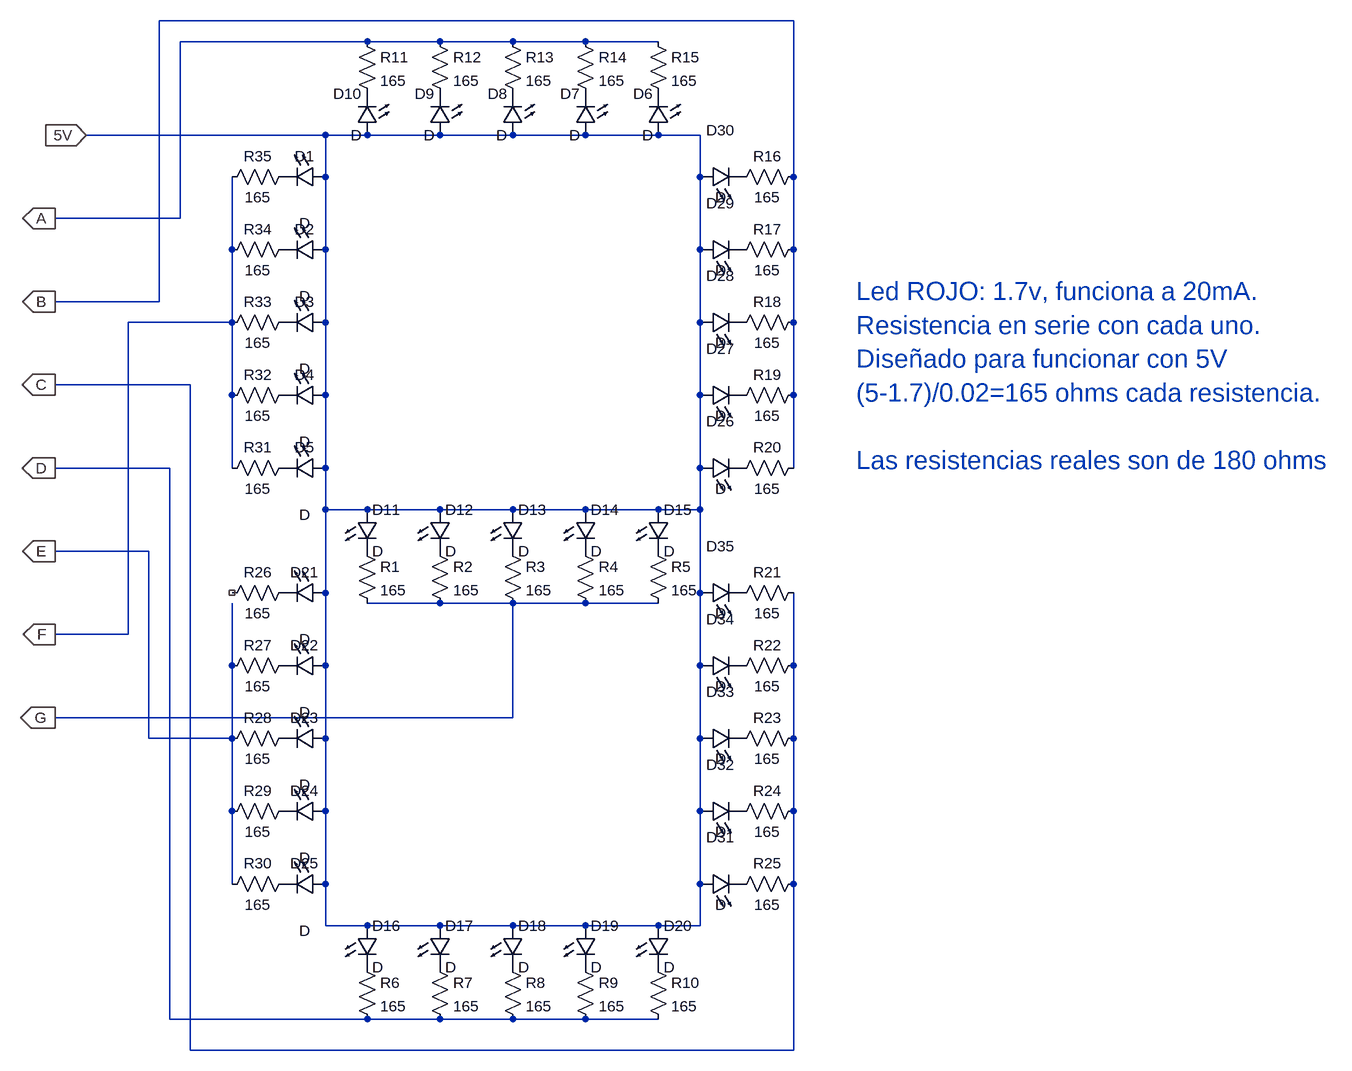
[diagram p0: schematic Display 7 segmentos.asc]
Display 7 segmentos.asc, the LTspice schematic file:
Version 4
SHEET 1 1560 1508
WIRE 592 -80 -384 -80
WIRE -64 -48 -352 -48
WIRE 48 -48 -64 -48
WIRE 160 -48 48 -48
WIRE 272 -48 160 -48
WIRE 384 -48 272 -48
WIRE -128 96 -496 96
WIRE -64 96 -128 96
WIRE 48 96 -64 96
WIRE 160 96 48 96
WIRE 272 96 160 96
WIRE 384 96 272 96
WIRE 448 96 384 96
WIRE -128 160 -128 96
WIRE 448 160 448 96
WIRE 592 160 592 -80
WIRE -352 224 -352 -48
WIRE -352 224 -544 224
WIRE -272 272 -272 160
WIRE -128 272 -128 160
WIRE 448 272 448 160
WIRE 592 272 592 160
WIRE -384 352 -384 -80
WIRE -384 352 -544 352
WIRE -272 384 -272 272
WIRE -272 384 -432 384
WIRE -128 384 -128 272
WIRE 448 384 448 272
WIRE 592 384 592 272
WIRE -336 480 -544 480
WIRE -272 496 -272 384
WIRE -128 496 -128 384
WIRE 448 496 448 384
WIRE 592 496 592 384
WIRE -368 608 -544 608
WIRE -272 608 -272 496
WIRE -128 608 -128 496
WIRE 448 608 448 496
WIRE 592 608 592 496
WIRE -128 672 -128 608
WIRE -64 672 -128 672
WIRE 48 672 -64 672
WIRE 160 672 48 672
WIRE 272 672 160 672
WIRE 384 672 272 672
WIRE 448 672 448 608
WIRE 448 672 384 672
WIRE -400 736 -544 736
WIRE -128 800 -128 672
WIRE 448 800 448 672
WIRE 48 816 -64 816
WIRE 160 816 48 816
WIRE 272 816 160 816
WIRE 384 816 272 816
WIRE -432 864 -432 384
WIRE -432 864 -544 864
WIRE -272 912 -272 816
WIRE -128 912 -128 800
WIRE 448 912 448 800
WIRE 592 912 592 800
WIRE 160 992 160 816
WIRE 160 992 -544 992
WIRE -400 1024 -400 736
WIRE -272 1024 -272 912
WIRE -272 1024 -400 1024
WIRE -128 1024 -128 912
WIRE 448 1024 448 912
WIRE 592 1024 592 912
WIRE -272 1136 -272 1024
WIRE -128 1136 -128 1024
WIRE 448 1136 448 1024
WIRE 592 1136 592 1024
WIRE -272 1248 -272 1136
WIRE -128 1248 -128 1136
WIRE 448 1248 448 1136
WIRE 592 1248 592 1136
WIRE -128 1312 -128 1248
WIRE -64 1312 -128 1312
WIRE 48 1312 -64 1312
WIRE 160 1312 48 1312
WIRE 272 1312 160 1312
WIRE 384 1312 272 1312
WIRE 448 1312 448 1248
WIRE 448 1312 384 1312
WIRE -368 1456 -368 608
WIRE -64 1456 -368 1456
WIRE 48 1456 -64 1456
WIRE 160 1456 48 1456
WIRE 272 1456 160 1456
WIRE 384 1456 272 1456
WIRE -336 1504 -336 480
WIRE 592 1504 592 1248
WIRE 592 1504 -336 1504
FLAG -496 96 5V
IOPIN -496 96 In
FLAG -544 224 A
IOPIN -544 224 Out
FLAG -544 352 B
IOPIN -544 352 Out
FLAG -544 480 C
IOPIN -544 480 Out
FLAG -544 608 D
IOPIN -544 608 Out
FLAG -544 736 E
IOPIN -544 736 Out
FLAG -544 864 F
IOPIN -544 864 Out
FLAG -544 992 G
IOPIN -544 992 Out
SYMBOL LED -128 144 R90
WINDOW 0 0 32 VBottom 2
WINDOW 3 72 32 VTop 2
SYMATTR InstName D1
SYMBOL LED -128 256 R90
WINDOW 0 0 32 VBottom 2
WINDOW 3 72 32 VTop 2
SYMATTR InstName D2
SYMBOL LED -128 368 R90
WINDOW 0 0 32 VBottom 2
WINDOW 3 72 32 VTop 2
SYMATTR InstName D3
SYMBOL LED -128 480 R90
WINDOW 0 0 32 VBottom 2
WINDOW 3 72 32 VTop 2
SYMATTR InstName D4
SYMBOL LED -128 592 R90
WINDOW 0 0 32 VBottom 2
WINDOW 3 72 32 VTop 2
SYMATTR InstName D5
SYMBOL LED 400 96 R180
WINDOW 0 24 64 Left 2
WINDOW 3 24 0 Left 2
SYMATTR InstName D6
SYMBOL LED 288 96 R180
WINDOW 0 24 64 Left 2
WINDOW 3 24 0 Left 2
SYMATTR InstName D7
SYMBOL LED 176 96 R180
WINDOW 0 24 64 Left 2
WINDOW 3 24 0 Left 2
SYMATTR InstName D8
SYMBOL LED 64 96 R180
WINDOW 0 24 64 Left 2
WINDOW 3 24 0 Left 2
SYMATTR InstName D9
SYMBOL LED -48 96 R180
WINDOW 0 24 64 Left 2
WINDOW 3 24 0 Left 2
SYMATTR InstName D10
SYMBOL LED -80 672 R0
SYMATTR InstName D11
SYMBOL LED 32 672 R0
SYMATTR InstName D12
SYMBOL LED 144 672 R0
SYMATTR InstName D13
SYMBOL LED 256 672 R0
SYMATTR InstName D14
SYMBOL LED 368 672 R0
SYMATTR InstName D15
SYMBOL LED -80 1312 R0
SYMATTR InstName D16
SYMBOL LED 32 1312 R0
SYMATTR InstName D17
SYMBOL LED 144 1312 R0
SYMATTR InstName D18
SYMBOL LED 256 1312 R0
SYMATTR InstName D19
SYMBOL LED 368 1312 R0
SYMATTR InstName D20
SYMBOL LED -128 784 R90
WINDOW 0 0 32 VBottom 2
WINDOW 3 72 32 VTop 2
SYMATTR InstName D21
SYMBOL LED -128 896 R90
WINDOW 0 0 32 VBottom 2
WINDOW 3 72 32 VTop 2
SYMATTR InstName D22
SYMBOL LED -128 1008 R90
WINDOW 0 0 32 VBottom 2
WINDOW 3 72 32 VTop 2
SYMATTR InstName D23
SYMBOL LED -128 1120 R90
WINDOW 0 0 32 VBottom 2
WINDOW 3 72 32 VTop 2
SYMATTR InstName D24
SYMBOL LED -128 1232 R90
WINDOW 0 0 32 VBottom 2
WINDOW 3 72 32 VTop 2
SYMATTR InstName D25
SYMBOL LED 448 624 R270
WINDOW 0 72 32 VTop 2
WINDOW 3 0 32 VBottom 2
SYMATTR InstName D26
SYMBOL LED 448 512 R270
WINDOW 0 72 32 VTop 2
WINDOW 3 0 32 VBottom 2
SYMATTR InstName D27
SYMBOL LED 448 400 R270
WINDOW 0 72 32 VTop 2
WINDOW 3 0 32 VBottom 2
SYMATTR InstName D28
SYMBOL LED 448 288 R270
WINDOW 0 72 32 VTop 2
WINDOW 3 0 32 VBottom 2
SYMATTR InstName D29
SYMBOL LED 448 176 R270
WINDOW 0 72 32 VTop 2
WINDOW 3 0 32 VBottom 2
SYMATTR InstName D30
SYMBOL LED 448 1264 R270
WINDOW 0 72 32 VTop 2
WINDOW 3 0 32 VBottom 2
SYMATTR InstName D31
SYMBOL LED 448 1152 R270
WINDOW 0 72 32 VTop 2
WINDOW 3 0 32 VBottom 2
SYMATTR InstName D32
SYMBOL LED 448 1040 R270
WINDOW 0 72 32 VTop 2
WINDOW 3 0 32 VBottom 2
SYMATTR InstName D33
SYMBOL LED 448 928 R270
WINDOW 0 72 32 VTop 2
WINDOW 3 0 32 VBottom 2
SYMATTR InstName D34
SYMBOL LED 448 816 R270
WINDOW 0 72 32 VTop 2
WINDOW 3 0 32 VBottom 2
SYMATTR InstName D35
SYMBOL res -80 720 R0
SYMATTR InstName R1
SYMATTR Value 165
SYMATTR SpiceLine tol=5 pwr=1/4
SYMBOL res 32 720 R0
SYMATTR InstName R2
SYMATTR Value 165
SYMATTR SpiceLine tol=5 pwr=1/4
SYMBOL res 144 720 R0
SYMATTR InstName R3
SYMATTR Value 165
SYMATTR SpiceLine tol=5 pwr=1/4
SYMBOL res 256 720 R0
SYMATTR InstName R4
SYMATTR Value 165
SYMATTR SpiceLine tol=5 pwr=1/4
SYMBOL res 368 720 R0
SYMATTR InstName R5
SYMATTR Value 165
SYMATTR SpiceLine tol=5 pwr=1/4
SYMBOL res -80 1360 R0
SYMATTR InstName R6
SYMATTR Value 165
SYMATTR SpiceLine tol=5 pwr=1/4
SYMBOL res 32 1360 R0
SYMATTR InstName R7
SYMATTR Value 165
SYMATTR SpiceLine tol=5 pwr=1/4
SYMBOL res 144 1360 R0
SYMATTR InstName R8
SYMATTR Value 165
SYMATTR SpiceLine tol=5 pwr=1/4
SYMBOL res 256 1360 R0
SYMATTR InstName R9
SYMATTR Value 165
SYMATTR SpiceLine tol=5 pwr=1/4
SYMBOL res 368 1360 R0
SYMATTR InstName R10
SYMATTR Value 165
SYMATTR SpiceLine tol=5 pwr=1/4
SYMBOL res -80 -64 R0
SYMATTR InstName R11
SYMATTR Value 165
SYMATTR SpiceLine tol=5 pwr=1/4
SYMBOL res 32 -64 R0
SYMATTR InstName R12
SYMATTR Value 165
SYMATTR SpiceLine tol=5 pwr=1/4
SYMBOL res 144 -64 R0
SYMATTR InstName R13
SYMATTR Value 165
SYMATTR SpiceLine tol=5 pwr=1/4
SYMBOL res 256 -64 R0
SYMATTR InstName R14
SYMATTR Value 165
SYMATTR SpiceLine tol=5 pwr=1/4
SYMBOL res 368 -64 R0
SYMATTR InstName R15
SYMATTR Value 165
SYMATTR SpiceLine tol=5 pwr=1/4
SYMBOL res 608 144 R90
WINDOW 0 0 56 VBottom 2
WINDOW 3 32 56 VTop 2
SYMATTR InstName R16
SYMATTR Value 165
SYMATTR SpiceLine tol=5 pwr=1/4
SYMBOL res 608 256 R90
WINDOW 0 0 56 VBottom 2
WINDOW 3 32 56 VTop 2
SYMATTR InstName R17
SYMATTR Value 165
SYMATTR SpiceLine tol=5 pwr=1/4
SYMBOL res 608 368 R90
WINDOW 0 0 56 VBottom 2
WINDOW 3 32 56 VTop 2
SYMATTR InstName R18
SYMATTR Value 165
SYMATTR SpiceLine tol=5 pwr=1/4
SYMBOL res 608 480 R90
WINDOW 0 0 56 VBottom 2
WINDOW 3 32 56 VTop 2
SYMATTR InstName R19
SYMATTR Value 165
SYMATTR SpiceLine tol=5 pwr=1/4
SYMBOL res 608 592 R90
WINDOW 0 0 56 VBottom 2
WINDOW 3 32 56 VTop 2
SYMATTR InstName R20
SYMATTR Value 165
SYMATTR SpiceLine tol=5 pwr=1/4
SYMBOL res 608 784 R90
WINDOW 0 0 56 VBottom 2
WINDOW 3 32 56 VTop 2
SYMATTR InstName R21
SYMATTR Value 165
SYMATTR SpiceLine tol=5 pwr=1/4
SYMBOL res 608 896 R90
WINDOW 0 0 56 VBottom 2
WINDOW 3 32 56 VTop 2
SYMATTR InstName R22
SYMATTR Value 165
SYMATTR SpiceLine tol=5 pwr=1/4
SYMBOL res 608 1008 R90
WINDOW 0 0 56 VBottom 2
WINDOW 3 32 56 VTop 2
SYMATTR InstName R23
SYMATTR Value 165
SYMATTR SpiceLine tol=5 pwr=1/4
SYMBOL res 608 1120 R90
WINDOW 0 0 56 VBottom 2
WINDOW 3 32 56 VTop 2
SYMATTR InstName R24
SYMATTR Value 165
SYMATTR SpiceLine tol=5 pwr=1/4
SYMBOL res 608 1232 R90
WINDOW 0 0 56 VBottom 2
WINDOW 3 32 56 VTop 2
SYMATTR InstName R25
SYMATTR Value 165
SYMATTR SpiceLine tol=5 pwr=1/4
SYMBOL res -176 784 R90
WINDOW 0 0 56 VBottom 2
WINDOW 3 32 56 VTop 2
SYMATTR InstName R26
SYMATTR Value 165
SYMATTR SpiceLine tol=5 pwr=1/4
SYMBOL res -176 896 R90
WINDOW 0 0 56 VBottom 2
WINDOW 3 32 56 VTop 2
SYMATTR InstName R27
SYMATTR Value 165
SYMATTR SpiceLine tol=5 pwr=1/4
SYMBOL res -176 1008 R90
WINDOW 0 0 56 VBottom 2
WINDOW 3 32 56 VTop 2
SYMATTR InstName R28
SYMATTR Value 165
SYMATTR SpiceLine tol=5 pwr=1/4
SYMBOL res -176 1120 R90
WINDOW 0 0 56 VBottom 2
WINDOW 3 32 56 VTop 2
SYMATTR InstName R29
SYMATTR Value 165
SYMATTR SpiceLine tol=5 pwr=1/4
SYMBOL res -176 1232 R90
WINDOW 0 0 56 VBottom 2
WINDOW 3 32 56 VTop 2
SYMATTR InstName R30
SYMATTR Value 165
SYMATTR SpiceLine tol=5 pwr=1/4
SYMBOL res -176 592 R90
WINDOW 0 0 56 VBottom 2
WINDOW 3 32 56 VTop 2
SYMATTR InstName R31
SYMATTR Value 165
SYMATTR SpiceLine tol=5 pwr=1/4
SYMBOL res -176 480 R90
WINDOW 0 0 56 VBottom 2
WINDOW 3 32 56 VTop 2
SYMATTR InstName R32
SYMATTR Value 165
SYMATTR SpiceLine tol=5 pwr=1/4
SYMBOL res -176 368 R90
WINDOW 0 0 56 VBottom 2
WINDOW 3 32 56 VTop 2
SYMATTR InstName R33
SYMATTR Value 165
SYMATTR SpiceLine tol=5 pwr=1/4
SYMBOL res -176 256 R90
WINDOW 0 0 56 VBottom 2
WINDOW 3 32 56 VTop 2
SYMATTR InstName R34
SYMATTR Value 165
SYMATTR SpiceLine tol=5 pwr=1/4
SYMBOL res -176 144 R90
WINDOW 0 0 56 VBottom 2
WINDOW 3 32 56 VTop 2
SYMATTR InstName R35
SYMATTR Value 165
SYMATTR SpiceLine tol=5 pwr=1/4
TEXT 688 336 Left 4 ;Led ROJO: 1.7v, funciona a 20mA.\nResistencia en serie con cada uno.\nDiseñado para funcionar con 5V\n(5-1.7)/0.02=165 ohms cada resistencia.\n \nLas resistencias reales son de 180 ohms

The netlist it stands for:
* Display 7 segmentos.asc
D1 5V P001 D
D2 5V P002 D
D3 5V P003 D
D4 5V P004 D
D5 5V P005 D
D6 5V P006 D
D7 5V P007 D
D8 5V P008 D
D9 5V P009 D
D10 5V P010 D
D11 5V P011 D
D12 5V P012 D
D13 5V P013 D
D14 5V P014 D
D15 5V P015 D
D16 5V P016 D
D17 5V P017 D
D18 5V P018 D
D19 5V P019 D
D20 5V P020 D
D21 5V P021 D
D22 5V P022 D
D23 5V P023 D
D24 5V P024 D
D25 5V P025 D
D26 5V P026 D
D27 5V P027 D
D28 5V P028 D
D29 5V P029 D
D30 5V P030 D
D31 5V P031 D
D32 5V P032 D
D33 5V P033 D
D34 5V P034 D
D35 5V P035 D
R1 P011 G 165 tol=5 pwr=1/4
R2 P012 G 165 tol=5 pwr=1/4
R3 P013 G 165 tol=5 pwr=1/4
R4 P014 G 165 tol=5 pwr=1/4
R5 P015 G 165 tol=5 pwr=1/4
R6 P016 D 165 tol=5 pwr=1/4
R7 P017 D 165 tol=5 pwr=1/4
R8 P018 D 165 tol=5 pwr=1/4
R9 P019 D 165 tol=5 pwr=1/4
R10 P020 D 165 tol=5 pwr=1/4
R11 A P010 165 tol=5 pwr=1/4
R12 A P009 165 tol=5 pwr=1/4
R13 A P008 165 tol=5 pwr=1/4
R14 A P007 165 tol=5 pwr=1/4
R15 A P006 165 tol=5 pwr=1/4
R16 B P030 165 tol=5 pwr=1/4
R17 B P029 165 tol=5 pwr=1/4
R18 B P028 165 tol=5 pwr=1/4
R19 B P027 165 tol=5 pwr=1/4
R20 B P026 165 tol=5 pwr=1/4
R21 C P035 165 tol=5 pwr=1/4
R22 C P034 165 tol=5 pwr=1/4
R23 C P033 165 tol=5 pwr=1/4
R24 C P032 165 tol=5 pwr=1/4
R25 C P031 165 tol=5 pwr=1/4
R26 P021 NC_01 165 tol=5 pwr=1/4
R27 P022 E 165 tol=5 pwr=1/4
R28 P023 E 165 tol=5 pwr=1/4
R29 P024 E 165 tol=5 pwr=1/4
R30 P025 E 165 tol=5 pwr=1/4
R31 P005 F 165 tol=5 pwr=1/4
R32 P004 F 165 tol=5 pwr=1/4
R33 P003 F 165 tol=5 pwr=1/4
R34 P002 F 165 tol=5 pwr=1/4
R35 P001 F 165 tol=5 pwr=1/4
.model D D
.lib standard.dio
* Led ROJO: 1.7v, funciona a 20mA.
* Resistencia en serie con cada uno.
* Diseñado para funcionar con 5V
* (5-1.7)/0.02=165 ohms cada resistencia.
* Las resistencias reales son de 180 ohms
.backanno
.end